# EAGLE schematic Laser_Array_CPU_V1.1 (EAGLE 7.7.0)
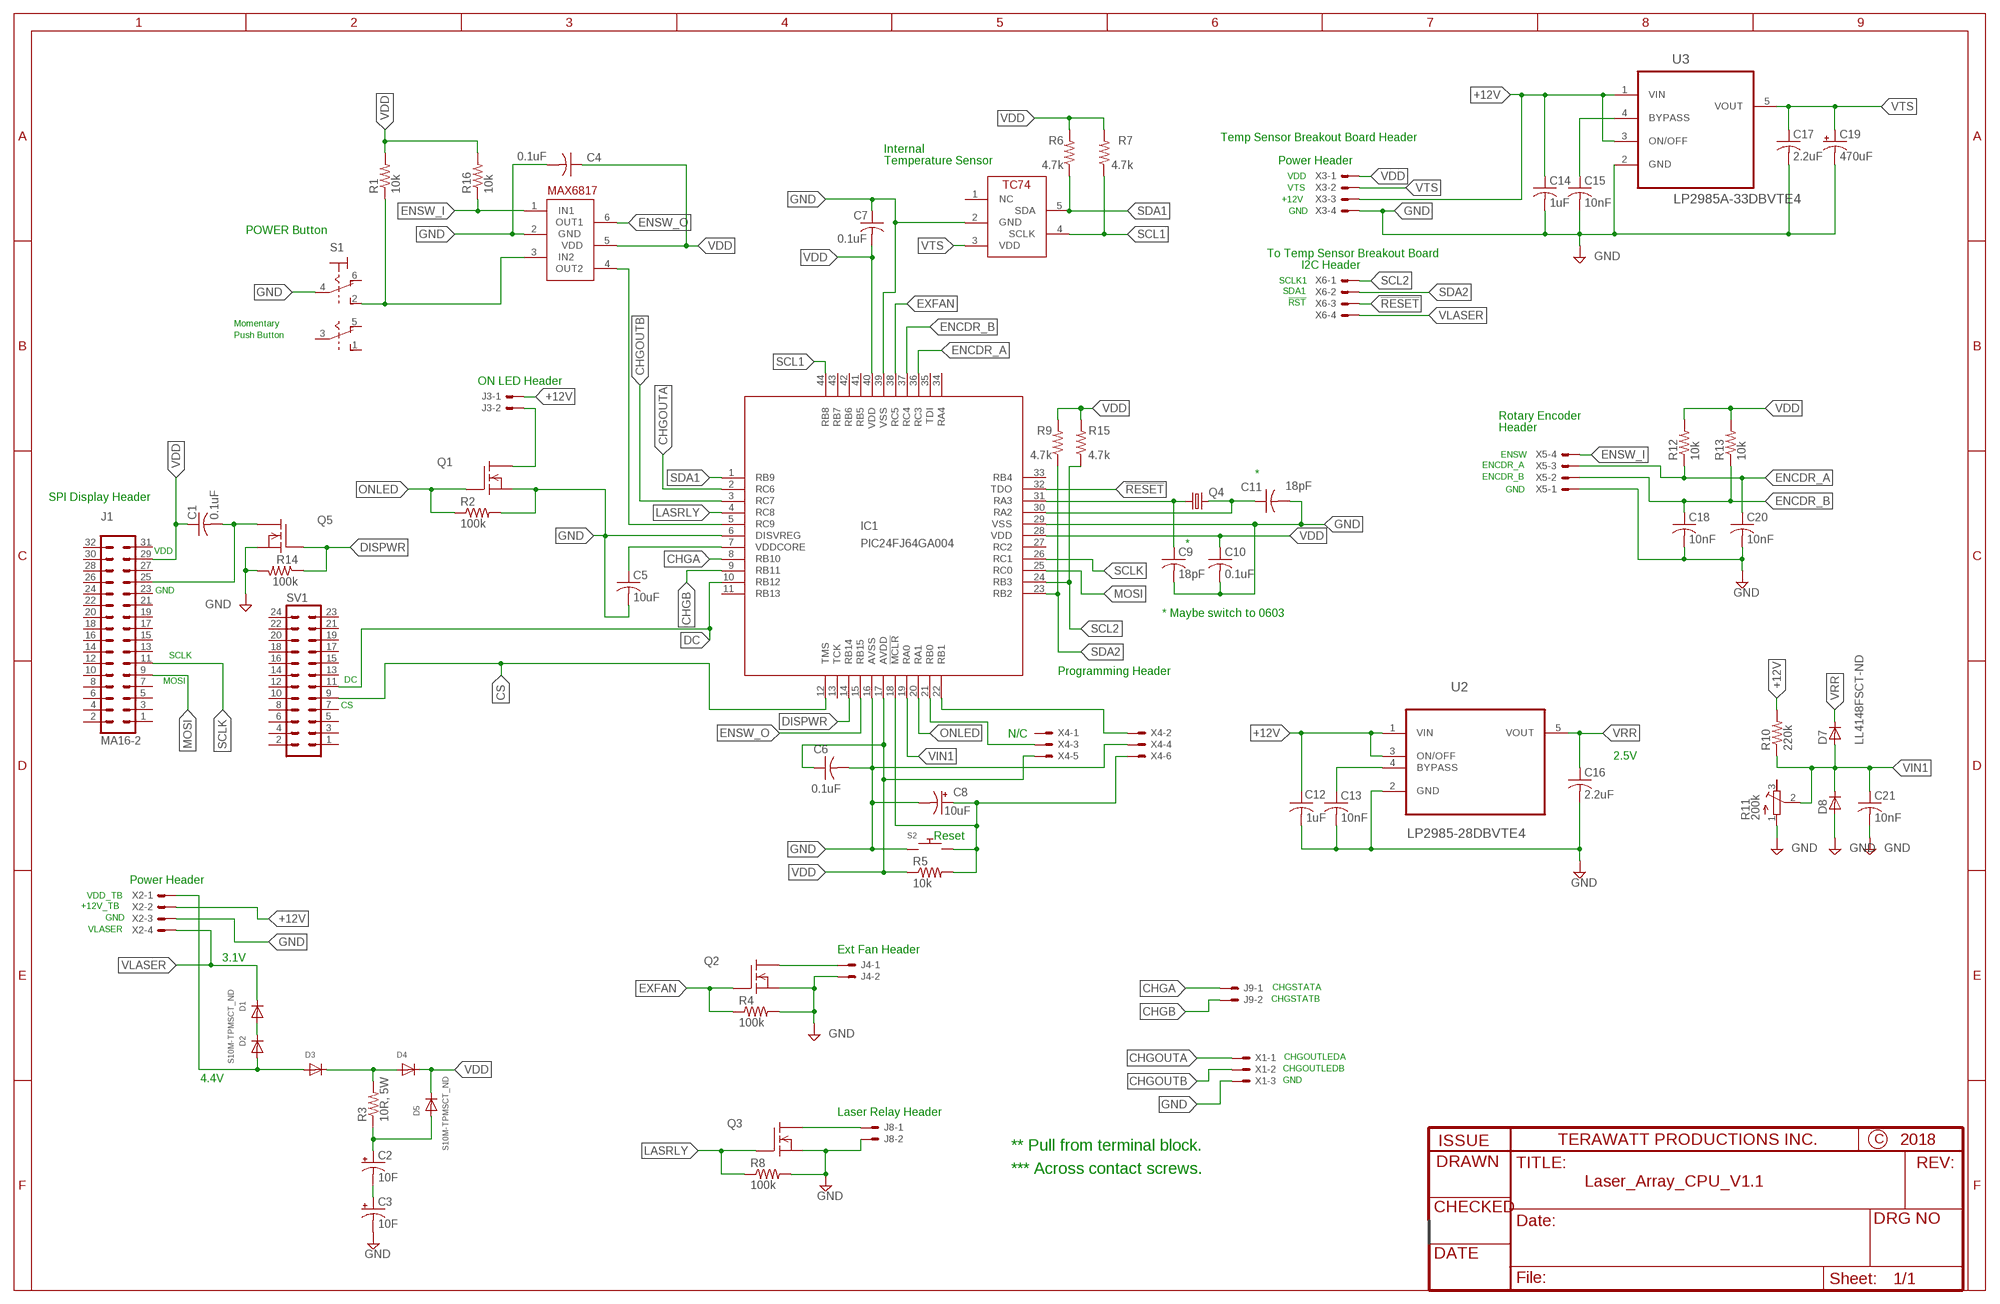
[diagram p0: schematic, sheet 1]

## Parts
C1  0.1uF  C-USC0805  [C0805]
C2  10F  CPOL-USE5-10.5  [E5-10,5]
C3  10F  CPOL-USE5-10.5  [E5-10,5]
C4  0.1uF  C-USC0805  [C0805]
C5  10uF  C-USC0805  [C0805]
C6  0.1uF  C-USC0805  [C0805]
C7  0.1uF  C-USC0805  [C0805]
C8  10uF  CAP3X3  [CAP3X3]
C9  18pF  C-USC0805  [C0805]
C10  0.1uF  C-USC0805  [C0805]
C11  18pF  C-USC0805  [C0805]
C12  1uF  C-USC0805  [C0805]
C13  10nF  C-USC0805  [C0805]
C14  1uF  C-USC0805  [C0805]
C15  10nF  C-USC0805  [C0805]
C16  2.2uF  C-USC0805  [C0805]
C17  2.2uF  C-USC0805  [C0805]
C18  10nF  C-USC0805  [C0805]
C19  470uF  CPOL-USF  [PANASONIC_F]
C20  10nF  C-USC0805  [C0805]
C21  10nF  C-USC0805  [C0805]
D1  S10M-TPMSCT_ND  [S10M-TPMSCT-ND]
D2  641-1014-6-ND  DIODESOD-123  [SOD-123]
D3  641-1014-6-ND  DIODESOD-123  [SOD-123]
D4  641-1014-6-ND  DIODESOD-123  [SOD-123]
D5  S10M-TPMSCT_ND  [S10M-TPMSCT-ND]
D7  LL4148FSCT-ND  D-SOD-80  [SOD80]
D8  LL4148FSCT-ND  D-SOD-80  [SOD80]
IC1  PIC24FJ64GA004  [TQFP44]
J1  MA16-2  [MA16-2]
J3  22-23-2021  [22-23-2021]
J4  22-23-2021  [22-23-2021]
J8  22-23-2021  [22-23-2021]
J9  22-23-2021  [22-23-2021]
Q1  QS5U34CT-ND_MOSFET_N_CHANNEL  [SOT23-5L]
Q2  QS5U34CT-ND_MOSFET_N_CHANNEL  [SOT23-5L]
Q3  QS5U34CT-ND_MOSFET_N_CHANNEL  [SOT23-5L]
Q4  CRYSTALSM49  [SM49]
Q5  QS5U34CT-ND_MOSFET_N_CHANNEL  [SOT23-5L]
R1  10k  R-US_R0805  [R0805]
R2  100k  R-US_R0805  [R0805]
R3  10R, 5W  RESISTOR5W  [RESISTOR5W]
R4  100k  R-US_R0805  [R0805]
R5  10k  R-US_R0805  [R0805]
R6  4.7k  R-US_M0805  [M0805]
R7  4.7k  R-US_M0805  [M0805]
R8  100k  R-US_R0805  [R0805]
R9  4.7k  R-US_M0805  [M0805]
R10  220k  R-US_M0805  [M0805]
R11  200k  R-TRIMM3224X  [RTRIM3224X]
R12  10k  R-US_M0805  [M0805]
R13  10k  R-US_M0805  [M0805]
R14  100k  R-US_R0805  [R0805]
R15  4.7k  R-US_M0805  [M0805]
R16  10k  R-US_R0805  [R0805]
S1  DPDT_TOGGLE  [22-23-2061]
S2  TACT_PB  [PUSHBUTTON_SMD_SJ]
S3  TC74  [SOT23-5L]
SV1  MA12-2  [MA12-2]
U1  MAX6817  [SOT23-6]
U2  LP2985-28DBVTE4  [SOT95P280X145-5N]
U3  LP2985A-33DBVTE4  [SOT95P280X145-5N]
X1  22-23-2031  [22-23-2031]
X2  22-23-2041  [22-23-2041]
X3  22-23-2041  [22-23-2041]
X4  87758-0616  [87758-0616]
X5  22-23-2041  [22-23-2041]
X6  22-23-2041  [22-23-2041]

## Nets
!RESET: IC1.32(TDO) X6.3
+12V: C12.1 C14.1 J3.1 R10.2 U2.1(VIN) U2.3(ON/OFF) U3.1(VIN) U3.3(ON/OFF) X2.2 X3.3
CHGA: IC1.8(RB10) J9.1
CHGB: IC1.9(RB11) J9.2
CHGOUTA: IC1.2(RC6) X1.1
CHGOUTB: IC1.3(RC7) X1.2
CS: IC1.12(TMS) SV1.9
DC: IC1.10(RB12) SV1.11
DISPWR: IC1.14(RB14) Q5.1(G) R14.1
ENCDR_A: C20.1 IC1.36(RC3) R12.1 X5.3
ENCDR_B: C18.1 IC1.37(RC4) R13.1 X5.2
ENSW_I: R16.1 U1.1(IN1) X5.4
ENSW_O: IC1.15(RB15) U1.6(OUT1)
EXFAN: IC1.38(RC5) Q2.1(G) R4.1
GND: C3.- C4.2 C5.2 C6.2 C7.1 C8.- C9.2 C10.2 C11.2 C12.2 C13.2 C14.2 C15.2 C16.2 C17.2 C18.2 C19.- C20.2 C21.2 D8.2(A) IC1.6(DISVREG) IC1.16(AVSS) IC1.29(VSS) IC1.39(VSS) J4.2 J8.2 Q1.2(S) Q2.2(S) Q3.2(S) Q5.2(S) R2.2 R4.2 R8.2 R11.1(A) R14.2 S1.4(P) S2.1 S2.2 S3.2(GND) U1.2(GND) U2.2(GND) U3.2(GND) X1.3 X2.3 X3.4 X4.4 X5.1
LASRLY: IC1.4(RC8) Q3.1(G) R8.1
MOSI: IC1.25(RC0) J1.9
N$1: C8.+ IC1.18(!MCLR) R5.2 S2.3 S2.4 X4.6
N$2: C5.1 IC1.7(VDDCORE)
N$4: IC1.22(RB1) X4.2
N$5: IC1.21(RB0) X4.3
N$6: C9.1 IC1.31(RA3) Q4.1
N$7: C11.1 IC1.30(RA2) Q4.2
N$8: C1.2 J1.25 Q5.5(D)
N$9: R1.1 S1.2(S) U1.3(IN2)
N$10: IC1.5(RC9) U1.4(OUT2)
N$11: J3.2 Q1.5(D)
N$15: D1.A D2.C
N$16: J4.1 Q2.5(D)
N$33: D3.C D4.A R3.2
N$34: J8.1 Q3.5(D)
N$35: C15.1 U3.4(BYPASS)
N$36: C2.- C3.+
N$37: C2.+ D5.A R3.1
N$55: C13.1 U2.4(BYPASS)
ONLED: IC1.20(RA1) Q1.1(G) R2.1
SCL1: IC1.44(RB8) R7.1 S3.4(SCLK)
SCL2: IC1.24(RB3) R15.1 X6.1
SCLK: IC1.26(RC1) J1.11
SDA1: IC1.1(RB9) R6.1 S3.5(SDA)
SDA2: IC1.23(RB2) R9.1 X6.2
VDD: C1.1 C4.1 C6.1 C7.2 C10.1 D4.C D5.C IC1.17(AVDD) IC1.28(VDD) IC1.40(VDD) J1.29 R1.2 R5.1 R6.2 R7.2 R9.2 R12.2 R13.2 R15.2 R16.2 U1.5(VDD) X3.1 X4.5
VDD_TB: D2.A D3.A X2.1
VIN1: C21.1 D7.2(A) D8.1(C) IC1.19(RA0) R10.1 R11.2(S)
VLASER: D1.C X2.4 X6.4
VRR: C16.1 D7.1(C) U2.5(VOUT)
VTS: C17.1 C19.+ S3.3(VDD) U3.5(VOUT) X3.2
Unconnected: IC1.11(RB13) IC1.13(TCK) IC1.27(RC2) IC1.33(RB4) IC1.34(RA4) IC1.35(TDI) IC1.41(RB5) IC1.42(RB6) IC1.43(RB7) J1.1 J1.2 J1.3 J1.4 J1.5 J1.6 J1.7 J1.8 J1.10 J1.12 J1.13 J1.14 J1.15 J1.16 J1.17 J1.18 J1.19 J1.20 J1.21 J1.22 J1.23 J1.24 J1.26 J1.27 J1.28 J1.30 J1.31 J1.32 R11.3(E) S1.1(S1) S1.3(P1) S1.5(O1) S1.6(O) S3.1(NC) SV1.1 SV1.2 SV1.3 SV1.4 SV1.5 SV1.6 SV1.7 SV1.8 SV1.10 SV1.12 SV1.13 SV1.14 SV1.15 SV1.16 SV1.17 SV1.18 SV1.19 SV1.20 SV1.21 SV1.22 SV1.23 SV1.24 X4.1

## Notes on the sheet
- Temp Sensor Breakout Board Header
- Internal
- Temperature Sensor | Power Header
- VDD
- VTS
- +12V
- GND
- POWER Button
- To Temp Sensor Breakout Board
- I2C Header
- SCLK1
- SDA1
- !RST
- Momentary
- Push Button
- ON LED Header
- Rotary Encoder
- Header
- ENSW
- ENCDR_A
- * | ENCDR_B
- GND
- SPI Display Header
- *
- VDD
- GND
- * Maybe switch to 0603
- SCLK
- Programming Header
- MOSI | DC
- CS
- N/C
- 2.5V
- Reset
- Power Header
- VDD_TB
- +12V_TB
- GND
- VLASER
- Ext Fan Header
- 3.1V
- CHGSTATA
- CHGSTATB
- CHGOUTLEDA
- CHGOUTLEDB
- 4.4V | GND
- Laser Relay Header
- ** Pull from terminal block.
- *** Across contact screws.

## Library data of the parts
C1 C4-C7 C9-C18 C20 C21 = rcl:C-US: CAPACITOR, American symbol
C2 C3 C19 = rcl:CPOL-US: POLARIZED CAPACITOR, American symbol
C8 = Mine:CAP3X3: capacitor - electrolytic This is from the Nichicon 3mm series
D1 D5 = Mine:S10M-TPMSCT_ND
D2-D4 = adafruit:DIODE: Diode SMADIODE - SMA Surface Mount Package 20V 1A Schottky Diode Digikey: 641-1014-6-ND DO-1N4148 - Through Hole Small Current Diode SOD-123 20V 1 A (.5mV Vf) Schottky Diode - Digikey: MBRX120TPMSCT-ND SOD-323 10V 570mA (.38mV Vf, 3ns) Schottky Diode - Digikey: ZLLS410CT-ND SOD-523 30V 30mA Schottky Diode (RB751S-40TE61) - Digikey: RB751S-40TE61CT-ND SOT23-R/W - SOT23 Package (R = Solder Paste/Reflow Ovens, W = Hand-Soldering) BAT54Film 40V 300mA - Digikey: 497-7162-1-ND
D7 D8 = semicon-smd-ipc:D-: DIODE unfilled
IC1 = microchip:PIC24FJ64GA004: PIC24FJ64GA004 edit this description Auto generated by make-symbol-device-package-bsdl.ulp Rev. 25 Source: PIC24FJ64GA004.bsd; MPN: PIC24FJ64GA004-E/PT; OC_FARNELL: 1332299; OC_NEWARK: 98M1927
J1 = Mine:MA16-2
J3 J4 J8 J9 = Mine:22-23-2021: .100" (2.54mm) Center Header - 2 Pin; MF: MOLEX; MPN: 22-23-2021; OC_FARNELL: 1462926; OC_NEWARK: 25C3832
Q1-Q3 Q5 = Mine:QS5U34CT-ND_MOSFET_N_CHANNEL: QS5U34CT-ND Enhancement mode, N-channel MOSFET Package: SOT 23-5
Q4 = adafruit:CRYSTAL: CRYSTAL; OC_FARNELL: unknown; OC_NEWARK: unknown
R1 R2 R4-R10 R12-R16 = rcl:R-US_: RESISTOR, American symbol
R3 = Mine:RESISTOR5W: 5W SMD resistor, uses standard 5W through hole resistor.
R11 = rcl:R-TRIMM: Trimm resistor
S1 = Mine:DPDT_TOGGLE
S2 = Mine:TACT_PB: Surfacemount tactile push button 6mm body Digikeyn part£:n CKN9085ct-nd
S3 = Mine:TC74
SV1 = con-lstb:MA12-2: PIN HEADER; OC_FARNELL: unknown; OC_NEWARK: unknown
U1 = Mine:MAX6817: MAX6817 2 channel CMOS switch debouncer Package SOT 23-6
U2 = Texas Instruments_By_element14_Batch_1:LP2985-28DBVTE4: LOW-NOISE LOW-DROPOUT REGULATOR WITH SHUTDOWN; MPN: LP2985-28DBVTE4; OC_FARNELL: 1053676; OC_NEWARK: 97K3681; PACKAGE: SOT-23-5; SUPPLIER: Texas Instruments
U3 = Texas Instruments_By_element14_Batch_1:LP2985A-33DBVTE4: 150-mA LOW-NOISE LOW-DROPOUT REGULATOR WITH SHUTDOWN; MPN: LP2985A-33DBVTE4; OC_FARNELL: 1053660; OC_NEWARK: 79K3928; PACKAGE: SOT-23-5; SUPPLIER: Texas Instruments
X1 = Mine:22-23-2031: .100" (2.54mm) Center Header - 3 Pin; MF: MOLEX; MPN: 22-23-2031; OC_FARNELL: 1462950; OC_NEWARK: 30C0862
X2 X3 X5 X6 = Mine:22-23-2041: .100" (2.54mm) Center Header - 4 Pin; MF: MOLEX; MPN: 22-23-2041; OC_FARNELL: 1462920; OC_NEWARK: 38C0355
X4 = Mine:87758-0616: 6 Pin - 2mm Dual Row Single Wafer, Vertical T/H HDR Source: http://www.molex.com/pdm_docs/sd/877580616_sd.pdf; MPN: 87758-0616; OC_FARNELL: 7472323; OC_NEWARK: 25M5667

## Net classes
0 default: width 0.254 mm, drill 0.508 mm, clearance 0.203 mm